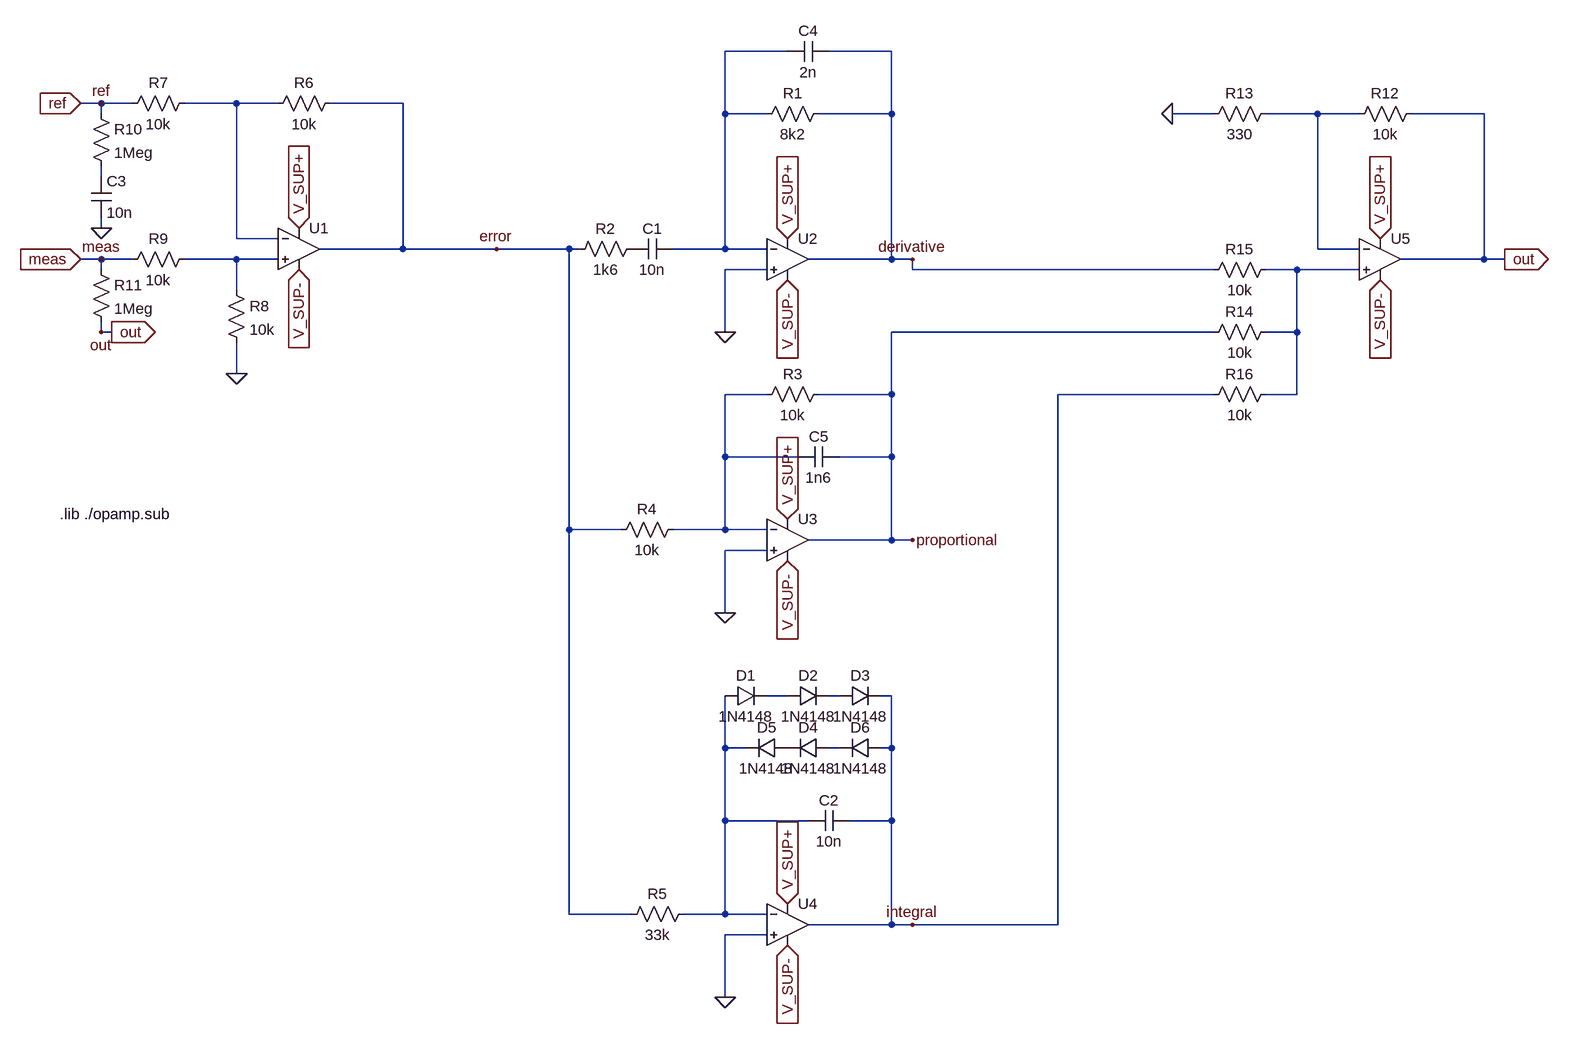
[diagram p0: schematic control_var.asc]
control_var.asc, the LTspice schematic file:
Version 4
SHEET 1 1552 964
WIRE 352 -560 256 -560
WIRE 512 -560 416 -560
WIRE -704 -480 -736 -480
WIRE -656 -480 -704 -480
WIRE -496 -480 -576 -480
WIRE -432 -480 -496 -480
WIRE -240 -480 -352 -480
WIRE -704 -464 -704 -480
WIRE 256 -464 256 -560
WIRE 320 -464 256 -464
WIRE 512 -464 512 -560
WIRE 512 -464 400 -464
WIRE 1008 -464 944 -464
WIRE 1168 -464 1088 -464
WIRE 1232 -464 1168 -464
WIRE 1424 -464 1312 -464
WIRE -704 -368 -704 -384
WIRE -704 -288 -704 -304
WIRE -496 -272 -496 -480
WIRE -432 -272 -496 -272
WIRE -240 -256 -240 -480
WIRE -240 -256 -368 -256
WIRE -96 -256 -240 -256
WIRE 16 -256 -96 -256
WIRE 32 -256 16 -256
WIRE 256 -256 256 -464
WIRE 256 -256 176 -256
WIRE 320 -256 256 -256
WIRE 1168 -256 1168 -464
WIRE 1232 -256 1168 -256
WIRE -704 -240 -736 -240
WIRE -656 -240 -704 -240
WIRE -496 -240 -576 -240
WIRE -432 -240 -496 -240
WIRE 512 -240 512 -464
WIRE 512 -240 384 -240
WIRE 544 -240 512 -240
WIRE 1424 -240 1424 -464
WIRE 1424 -240 1296 -240
WIRE 1456 -240 1424 -240
WIRE -704 -224 -704 -240
WIRE 320 -224 256 -224
WIRE 544 -224 544 -240
WIRE 1008 -224 544 -224
WIRE 1136 -224 1088 -224
WIRE 1232 -224 1136 -224
WIRE -496 -192 -496 -240
WIRE -704 -128 -704 -144
WIRE -688 -128 -704 -128
WIRE 256 -128 256 -224
WIRE 1008 -128 512 -128
WIRE 1136 -128 1136 -224
WIRE 1136 -128 1088 -128
WIRE -496 -64 -496 -112
WIRE 320 -32 256 -32
WIRE 512 -32 512 -128
WIRE 512 -32 400 -32
WIRE 1008 -32 768 -32
WIRE 1136 -32 1136 -128
WIRE 1136 -32 1088 -32
WIRE 256 64 256 -32
WIRE 368 64 256 64
WIRE 512 64 512 -32
WIRE 512 64 432 64
WIRE 16 176 16 -256
WIRE 96 176 16 176
WIRE 256 176 256 64
WIRE 256 176 176 176
WIRE 320 176 256 176
WIRE 512 192 512 64
WIRE 512 192 384 192
WIRE 544 192 512 192
WIRE 320 208 256 208
WIRE 256 304 256 208
WIRE 352 432 320 432
WIRE 432 432 416 432
WIRE 512 432 496 432
WIRE 256 512 256 432
WIRE 288 512 256 512
WIRE 432 512 416 512
WIRE 512 512 512 432
WIRE 512 512 496 512
WIRE 256 624 256 512
WIRE 384 624 256 624
WIRE 512 624 512 512
WIRE 512 624 448 624
WIRE 16 768 16 176
WIRE 112 768 16 768
WIRE 256 768 256 624
WIRE 256 768 192 768
WIRE 320 768 256 768
WIRE 512 784 512 624
WIRE 512 784 384 784
WIRE 544 784 512 784
WIRE 768 784 768 -32
WIRE 768 784 544 784
WIRE 320 800 256 800
WIRE 256 896 256 800
FLAG 256 -128 0
FLAG 544 -240 derivative
FLAG -96 -256 error
FLAG 256 304 0
FLAG 544 192 proportional
FLAG 352 -272 V_SUP+
IOPIN 352 -272 In
FLAG 352 160 V_SUP+
IOPIN 352 160 In
FLAG 352 -208 V_SUP-
IOPIN 352 -208 In
FLAG 352 224 V_SUP-
IOPIN 352 224 In
FLAG 352 752 V_SUP+
IOPIN 352 752 In
FLAG 352 816 V_SUP-
IOPIN 352 816 In
FLAG 256 896 0
FLAG 544 784 integral
FLAG -496 -64 0
FLAG -400 -288 V_SUP+
IOPIN -400 -288 In
FLAG -400 -224 V_SUP-
IOPIN -400 -224 In
FLAG -736 -480 ref
IOPIN -736 -480 In
FLAG -736 -240 meas
IOPIN -736 -240 In
FLAG -704 -288 0
FLAG -688 -128 out
IOPIN -688 -128 Out
FLAG 1264 -272 V_SUP+
IOPIN 1264 -272 In
FLAG 1264 -208 V_SUP-
IOPIN 1264 -208 In
FLAG 944 -464 0
FLAG 1456 -240 out
IOPIN 1456 -240 Out
FLAG -704 -480 ref
FLAG -704 -240 meas
FLAG -704 -128 out
SYMBOL res 416 -480 R90
WINDOW 0 0 56 VBottom 2
WINDOW 3 32 56 VTop 2
SYMATTR InstName R1
SYMATTR Value 8k2
SYMBOL cap 176 -272 R90
WINDOW 0 0 32 VBottom 2
WINDOW 3 32 32 VTop 2
SYMATTR InstName C1
SYMATTR Value 10n
SYMBOL res 416 -48 R90
WINDOW 0 0 56 VBottom 2
WINDOW 3 32 56 VTop 2
SYMATTR InstName R3
SYMATTR Value 10k
SYMBOL res 192 160 R90
WINDOW 0 0 56 VBottom 2
WINDOW 3 32 56 VTop 2
SYMATTR InstName R4
SYMATTR Value 10k
SYMBOL cap 448 608 R90
WINDOW 0 0 32 VBottom 2
WINDOW 3 32 32 VTop 2
SYMATTR InstName C2
SYMATTR Value 10n
SYMBOL res 208 752 R90
WINDOW 0 0 56 VBottom 2
WINDOW 3 32 56 VTop 2
SYMATTR InstName R5
SYMATTR Value 33k
SYMBOL diode 256 448 R270
WINDOW 0 32 32 VTop 2
WINDOW 3 0 32 VBottom 2
SYMATTR InstName D1
SYMATTR Value 1N4148
SYMBOL diode 352 448 R270
WINDOW 0 32 32 VTop 2
WINDOW 3 0 32 VBottom 2
SYMATTR InstName D2
SYMATTR Value 1N4148
SYMBOL diode 432 448 R270
WINDOW 0 32 32 VTop 2
WINDOW 3 0 32 VBottom 2
SYMATTR InstName D3
SYMATTR Value 1N4148
SYMBOL diode 416 496 R90
WINDOW 0 0 32 VBottom 2
WINDOW 3 32 32 VTop 2
SYMATTR InstName D4
SYMATTR Value 1N4148
SYMBOL res -336 -496 R90
WINDOW 0 0 56 VBottom 2
WINDOW 3 32 56 VTop 2
SYMATTR InstName R6
SYMATTR Value 10k
SYMBOL res -560 -496 R90
WINDOW 0 0 56 VBottom 2
WINDOW 3 32 56 VTop 2
SYMATTR InstName R7
SYMATTR Value 10k
SYMBOL res -512 -208 R0
SYMATTR InstName R8
SYMATTR Value 10k
SYMBOL res -560 -256 R90
WINDOW 0 0 56 VBottom 2
WINDOW 3 32 56 VTop 2
SYMATTR InstName R9
SYMATTR Value 10k
SYMBOL res -720 -480 R0
SYMATTR InstName R10
SYMATTR Value 1Meg
SYMBOL cap -720 -368 R0
SYMATTR InstName C3
SYMATTR Value 10n
SYMBOL res -720 -240 R0
SYMATTR InstName R11
SYMATTR Value 1Meg
SYMBOL res 1328 -480 R90
WINDOW 0 0 56 VBottom 2
WINDOW 3 32 56 VTop 2
SYMATTR InstName R12
SYMATTR Value 10k
SYMBOL res 1104 -480 R90
WINDOW 0 0 56 VBottom 2
WINDOW 3 32 56 VTop 2
SYMATTR InstName R13
SYMATTR Value 330
SYMBOL res 1104 -240 R90
WINDOW 0 0 56 VBottom 2
WINDOW 3 32 56 VTop 2
SYMATTR InstName R15
SYMATTR Value 10k
SYMBOL res 1104 -144 R90
WINDOW 0 0 56 VBottom 2
WINDOW 3 32 56 VTop 2
SYMATTR InstName R14
SYMATTR Value 10k
SYMBOL res 1104 -48 R90
WINDOW 0 0 56 VBottom 2
WINDOW 3 32 56 VTop 2
SYMATTR InstName R16
SYMATTR Value 10k
SYMBOL res 128 -272 R90
WINDOW 0 0 56 VBottom 2
WINDOW 3 32 56 VTop 2
SYMATTR InstName R2
SYMATTR Value 1k6
SYMBOL cap 416 -576 R90
WINDOW 0 0 32 VBottom 2
WINDOW 3 32 32 VTop 2
SYMATTR InstName C4
SYMATTR Value 2n
SYMBOL cap 432 48 R90
WINDOW 0 0 32 VBottom 2
WINDOW 3 32 32 VTop 2
SYMATTR InstName C5
SYMATTR Value 1n6
SYMBOL diode 352 496 R90
WINDOW 0 0 32 VBottom 2
WINDOW 3 32 32 VTop 2
SYMATTR InstName D5
SYMATTR Value 1N4148
SYMBOL diode 496 496 R90
WINDOW 0 0 32 VBottom 2
WINDOW 3 32 32 VTop 2
SYMATTR InstName D6
SYMATTR Value 1N4148
SYMBOL OpAmps\\UniversalOpAmp2 -400 -256 R0
SYMATTR InstName U1
SYMATTR Value2 Avol=1Meg GBW=70Meg Slew=20Meg
SYMATTR SpiceLine Ilimit=60m Rail=0 Vos=0
SYMBOL OpAmps\\UniversalOpAmp2 352 -240 R0
SYMATTR InstName U2
SYMATTR Value2 Avol=1Meg GBW=70Meg Slew=20Meg
SYMATTR SpiceLine Ilimit=60m Rail=0 Vos=0
SYMBOL OpAmps\\UniversalOpAmp2 352 192 R0
SYMATTR InstName U3
SYMATTR Value2 Avol=1Meg GBW=70Meg Slew=20Meg
SYMATTR SpiceLine Ilimit=60m Rail=0 Vos=0
SYMBOL OpAmps\\UniversalOpAmp2 352 784 R0
SYMATTR InstName U4
SYMATTR Value2 Avol=1Meg GBW=70Meg Slew=20Meg
SYMATTR SpiceLine Ilimit=60m Rail=0 Vos=0
SYMBOL OpAmps\\UniversalOpAmp2 1264 -240 R0
SYMATTR InstName U5
SYMATTR Value2 Avol=1Meg GBW=70Meg Slew=20Meg
SYMATTR SpiceLine Ilimit=60m Rail=0 Vos=0
TEXT -768 152 Left 2 !.lib ./opamp.sub

The netlist it stands for:
* control_var.asc
R1 derivative N001 8k2
C1 N001 P001 10n
R3 proportional N007 10k
R4 N007 error 10k
C2 integral N010 10n
R5 N010 error 33k
D1 N010 N008 1N4148
D2 N008 N009 1N4148
D3 N009 integral 1N4148
D4 N011 P002 1N4148
R6 error N002 10k
R7 N002 ref 10k
R8 N005 0 10k
R9 N005 meas 10k
R10 ref N004 1Meg
C3 N004 0 10n
R11 meas out 1Meg
R12 out N003 10k
R13 N003 0 330
R15 N006 derivative 10k
R14 N006 proportional 10k
R16 N006 integral 10k
R2 P001 error 1k6
C4 derivative N001 2n
C5 proportional N007 1n6
D5 P002 N010 1N4148
D6 integral N011 1N4148
XU1 N005 N002 V_SUP+ V_SUP- error level2 Avol=1Meg GBW=70Meg Slew=20Meg Ilimit=60m Rail=0 Vos=0 En=0 Enk=0 In=0 Ink=0 Rin=500Meg  ; pins In+ In- V+ V- OUT
XU2 0 N001 V_SUP+ V_SUP- derivative level2 Avol=1Meg GBW=70Meg Slew=20Meg Ilimit=60m Rail=0 Vos=0 En=0 Enk=0 In=0 Ink=0 Rin=500Meg  ; pins In+ In- V+ V- OUT
XU3 0 N007 V_SUP+ V_SUP- proportional level2 Avol=1Meg GBW=70Meg Slew=20Meg Ilimit=60m Rail=0 Vos=0 En=0 Enk=0 In=0 Ink=0 Rin=500Meg  ; pins In+ In- V+ V- OUT
XU4 0 N010 V_SUP+ V_SUP- integral level2 Avol=1Meg GBW=70Meg Slew=20Meg Ilimit=60m Rail=0 Vos=0 En=0 Enk=0 In=0 Ink=0 Rin=500Meg  ; pins In+ In- V+ V- OUT
XU5 N006 N003 V_SUP+ V_SUP- out level2 Avol=1Meg GBW=70Meg Slew=20Meg Ilimit=60m Rail=0 Vos=0 En=0 Enk=0 In=0 Ink=0 Rin=500Meg  ; pins In+ In- V+ V- OUT
.model D D
.lib standard.dio
.lib ./opamp.sub
.lib UniversalOpAmp2.lib
.backanno
.end